# Altium project JacdacTempRhEc30 116.PrjPCB
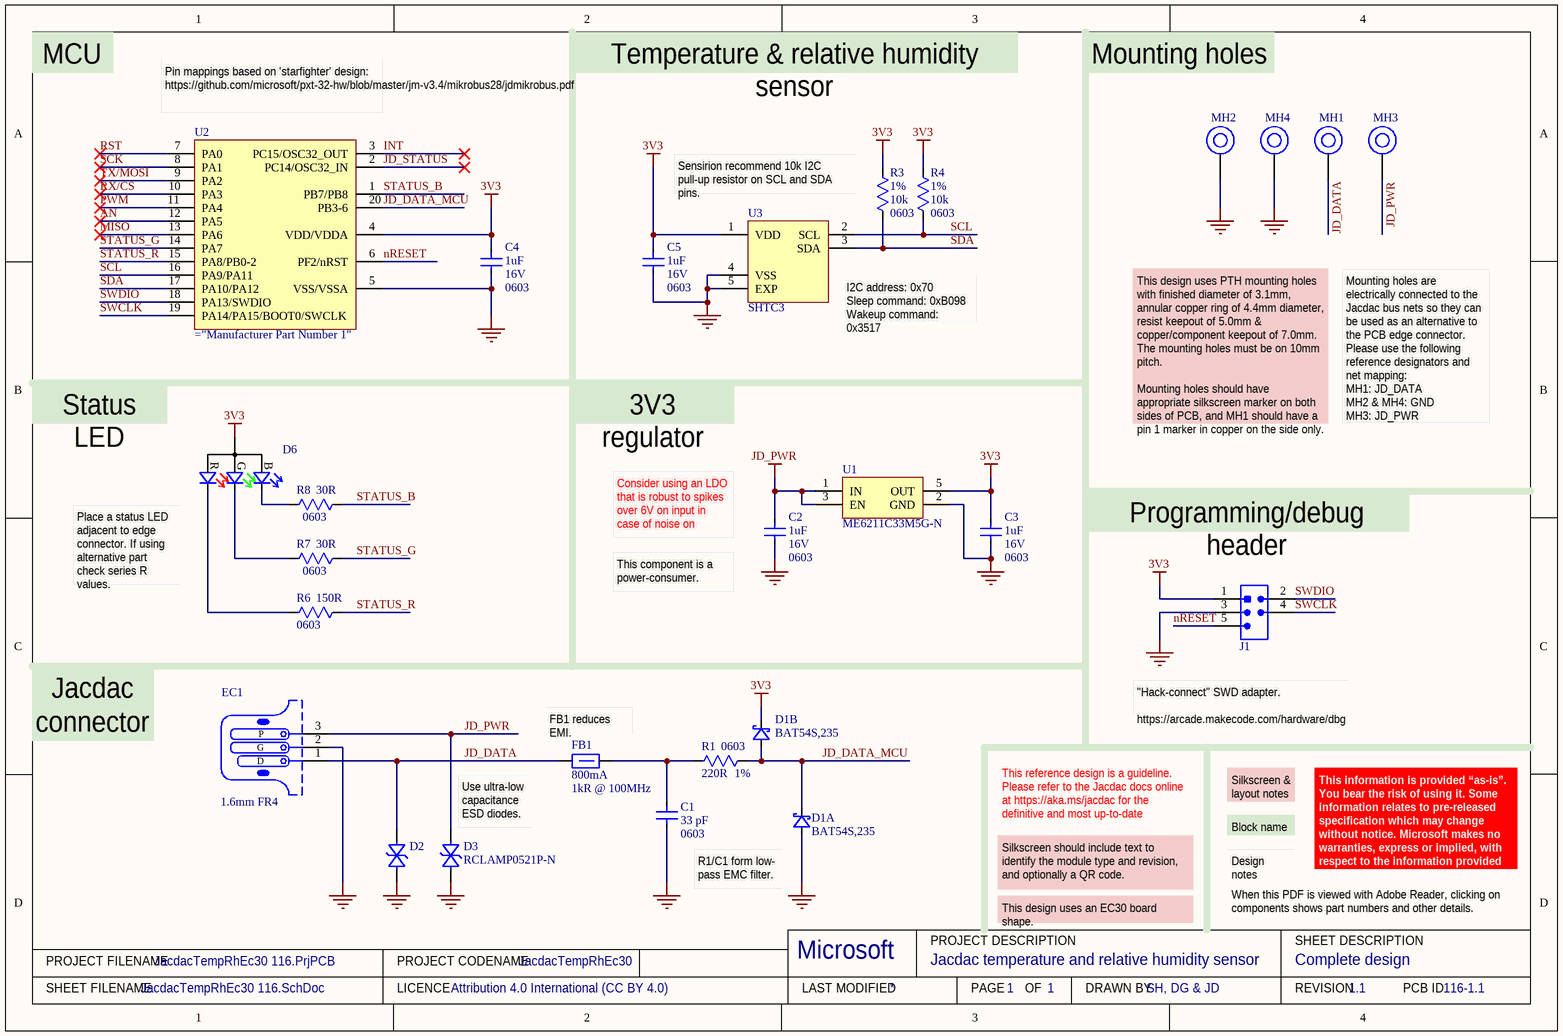
[diagram p0: JacdacTempRhEc30 116.SchDoc]
ProjectCodeName: JacdacTempRhEc30; ProjectCodenameDescription: Jacdac temperature and relative humidity sensor; ProjectCodenameID: 116; ProjectDrawnBy: SH, DG & JD; ProjectLicenceTerms: Attribution 4.0 International (CC BY 4.0); ProjectRevision: 1.1
1 sheet, 25 parts. Net scope: global (net labels, ports and power ports of the same name join across sheets).
Board file: JacdacTempRhEc30 116.PcbDoc

## Sheet JacdacTempRhEc30 116.SchDoc: Complete design
size A4; DrawnBy: SH, DG & JD; DocumentNumber: 1; Revision: 1.1; SheetNumber: 1; SheetTotal: 1; VersionControl_RevNumber: 1

### Parts
C1  33 pF  Case/Package: 0603  [CC0603]
C2  Voltage: 16V  Case/Package: 0603  Capacitance: 1uF  [C0603 - without outline]  (hidden comment: 1uF 16V)
C3  Voltage: 16V  Case/Package: 0603  Capacitance: 1uF  [C0603 - without outline]  (hidden comment: 1uF 16V)
C4  Voltage: 16V  Case/Package: 0603  Capacitance: 1uF  [C0603 - without outline]  (hidden comment: 1uF 16V)
C5  Voltage: 16V  Case/Package: 0603  Capacitance: 1uF  [C0603 - without outline]  (hidden comment: 1uF 16V)
D1  Manufacturer Part Number: BAT54S,235  [NXP-BAT54S-TO-236AB - without outline]  (hidden comment: BAT54S)  (parts A,B of 2)
D2  RCLAMP0521P-N  [TVS 0402 - XL]  (value not drawn)
D3  RCLAMP0521P-N  [TVS 0402 - XL]
D6  TZ-P4-1615RGBTCA1-0.55T  [TZ-P4-1615RGBTCA1-0.55T]  (value not drawn)
EC1  PCB Type: 1.6mm FR4  [JACDAC_EDGE_CONNECTOR_NO_TRACES]  (hidden comment: 3 pin JACDAC edge connector)  (no BOM)
FB1  Current Rating: 800mA  Impedance: 1kR @ 100MHz  [TDK MPZ1608 0.8mm - without outline]  (hidden comment: TDK MPZ1608S102ATA00)
J1  Hack Connect Mini 1.27 mm pitch 2-row  [HACK_CONNECT_MINI_5_X_1_27]  (value not drawn)  (no BOM)
MH1  MH_7.0MMK_4.4MMC_3.1MMD_PTH  [MH_7.0MMK_4.4MMC_3.1MMD_PTH]  (value not drawn)  (no BOM)
MH2  MH_7.0MMK_4.4MMC_3.1MMD_PTH  [MH_7.0MMK_4.4MMC_3.1MMD_PTH]  (value not drawn)  (no BOM)
MH3  MH_7.0MMK_4.4MMC_3.1MMD_PTH  [MH_7.0MMK_4.4MMC_3.1MMD_PTH]  (value not drawn)  (no BOM)
MH4  MH_7.0MMK_4.4MMC_3.1MMD_PTH  [MH_7.0MMK_4.4MMC_3.1MMD_PTH]  (value not drawn)  (no BOM)
R1  Tolerance: 1%  Case/Package: 0603  [RC0603]  (hidden comment: 220R)
R3  Tolerance: 1%  Case/Package: 0603  [RC0603]  (hidden comment: 10k)
R4  Tolerance: 1%  Case/Package: 0603  [RC0603]  (hidden comment: 10k)
R6  Case/Package: 0603  [RC0603]  (hidden comment: 150R)
R7  Case/Package: 0603  [RC0603]  (hidden comment: 30R)
R8  Case/Package: 0603  [RC0603]  (hidden comment: 30R)
U1  ME6211C33M5G-N  [MICRONE-SOT23-5]
U2  (no value)  [20-TSSOP]
U3  SHTC3  [SHTC3_4_WDFN]

### Nets
3V3: C3.2 C4.2 C5.2 D1.2(K) D6.1(A) J1.1(VCC) R3.1 R4.1 U1.5(OUT) U2.4(VDD/VDDA) U3.1(VDD)
GND: C1.1 C2.1 C3.1 C4.1 C5.1 D1.1(A) D2.2(A) D3.2(A) EC1.2(G) J1.3(GND) MH2.1 MH4.1 U1.2(GND) U2.5(VSS/VSSA) U3.4(VSS) U3.5(EXP)
JD_PWR: C2.2 D3.1(K) EC1.3(P) MH3.1 U1.1(IN) U1.3(EN)
AN: U2.12(PA5)
INT: U2.3(PC15/OSC32_OUT)
JD_DATA: D2.1(K) EC1.1(D) FB1.1 MH1.1
JD_DATA_MCU: D1.3(K) R1.2 U2.20(PB3-6)
JD_STATUS: U2.2(PC14/OSC32_IN)
MISO: U2.13(PA6)
nRESET: J1.5(RESET) U2.6(PF2/nRST)
PWM: U2.11(PA4)
RST: U2.7(PA0)
RX/CS: U2.10(PA3)
SCK: U2.8(PA1)
SCL: R4.2 U2.16(PA9/PA11) U3.2(SCL)
SDA: R3.2 U2.17(PA10/PA12) U3.3(SDA)
STATUS_B: R8.2 U2.1(PB7/PB8)
STATUS_G: R7.2 U2.14(PA7)
STATUS_R: R6.2 U2.15(PA8/PB0-2)
SWCLK: J1.4(SWCLK) U2.19(PA14/PA15/BOOT0/SWCLK)
SWDIO: J1.2(SWDIO) U2.18(PA13/SWDIO)
TX/MOSI: U2.9(PA2)
NetC1_2: C1.2 FB1.2 R1.1
NetD6_2: D6.2(R) R6.1
NetD6_3: D6.3(G) R7.1
NetD6_4: D6.4(B) R8.1

### Notes on the sheet
- MCU
- (near U2) Pin mappings based on 'starfighter' design: https://github.com/microsoft/pxt-32-hw/blob/master/jm-v3.4/mikrobus28/jdmikrobus.pdf
- Temperature & relative humidity sensor
- Mounting holes
- Sensirion recommend 10k I2C pull-up resistor on SCL and SDA pins.
- (near U3) I2C address: 0x70
  Sleep command: 0xB098
  Wakeup command: 0x3517
- Mounting holes are electrically connected to the Jacdac bus nets so they can be used as an alternative to the PCB edge connector. Please use the following reference designators and net mapping:
- Status LED
- 3V3 regulator
- This design uses PTH mounting holes with finished diameter of 3.1mm, annular copper ring of 4.4mm diameter, resist keepout of 5.0mm & copper/component keepout of 7.0mm. The mounting holes must be on 10mm pitch.
  Mounting holes should have appropriate silkscreen marker on both sides of PCB, and MH1 should have a pin 1 marker in copper on the side only.
- MH1: JD_DATA
  MH2 & MH4: GND
  MH3: JD_PWR
- (near D6) Place a status LED adjacent to edge connector. If using alternative part check series R values.
- (near C2) Consider using an LDO that is robust to spikes over 6V on input in case of noise on JD_PWR.
- Programming/debug header
- (near C2) This component is a power-consumer.
- Jacdac
- "Hack-connect" SWD adapter.
  https://arcade.makecode.com/hardware/dbg
- connector
- (near FB1) FB1 reduces EMI.
- (near D3) Use ultra-low capacitance ESD diodes.
- This reference design is a guideline. Please refer to the Jacdac docs online at https://aka.ms/jacdac for the definitive and most up-to-date information.
- Block name
- Silkscreen & layout notes
- R1/C1 form low-
  pass EMC filter.
- This design uses an EC30 board shape.
- Silkscreen should include text to identify the module type and revision, and optionally a QR code.
- D1 clamps JD_DATA to protect MCU.
- Design notes
- When this PDF is viewed with Adobe Reader, clicking on components shows part numbers and other details.
- This information is provided “as-is”. You bear the risk of using it. Some information relates to pre-released specification which may change without notice. Microsoft makes no warranties, express or implied, with respect to the information provided here.
- PROJECT FILENAME
- PROJECT CODENAME
- Microsoft
- PROJECT DESCRIPTION
- SHEET DESCRIPTION
- SHEET FILENAME
- LICENCE
- LAST MODIFIED
- PAGE
- OF
- DRAWN BY
- REVISION
- PCB ID

### Library data of the parts
C1 = CC0603JRNPO9BN330: 33pF 0603 100V C0G/NPO; Manufacturer: Yageo; Dielectric: C0G; Tolerance: 5%; Supplier 1: Digi-Key; Manufacturer Part Number: CC0603JRNPO9BN330; RoHS: Yes; Category: Ceramic Capacitors; Mount: Surface Mount; Weight: 7.1E-05oz; Case Code (Imperial): 0603; Case Code (Metric): 1608; Min Operating Temperature: -55°C; Max Operating Temperature: 125°C; Capacitance: 33pF; Termination: SMD/SMT; Composition: Ceramic; Packaging: Tape and Reel; Voltage Rating: 100V; Voltage Rating (DC): 100V; Length: 1.6mm; Height: 0.8mm; Thickness: 0.035inch; Depth: 0.8mm; Width: 0.8mm; Lead Free: Lead Free; ComponentLink1URL: https://datasheet.ciiva.com/13207/upy-gp-np0-16v-to-50v-8-13207786.pdf; ComponentLink1Description: Online datasheet; Manufacturer 1: Yageo; Manufacturer Part Number 1: CC0603JRNPO9BN330
C2-C5 = CL10A105KO8NNNC: SMD Multilayer Ceramic Capacitor, 1 µF, 16 V, 0603 [1608 Metric], ± 10%, X5R, CL Series; Manufacturer: Samsung; ComponentLink1URL: https://datasheet.lcsc.com/lcsc/1811021622_Samsung-Electro-Mechanics-CL10A105KO8NNNC_C1592.pdfq; ComponentLink1Description: Online datasheet; Supplier 1: Digi-Key; Manufacturer Part Number: CL10A105KO8NNNC; RoHS: Yes; Category: Ceramic Capacitors; Stock 1: 3575337; Pricing 1: 1=0.10000, 10=0.03600, 50=0.01960, 100=0.01600, 500=0.01144, 1000=0.00898 (USD); Mount: Surface Mount; Case Code (Metric): 1608; Case Code (Imperial): 0603; Material: Ceramic; Contact Plating: Tin; Min Operating Temperature: -55°C; Max Operating Temperature: 85°C; Tolerance: 10%; Package Quantity: 1; Packaging: Tape and Reel; Voltage Rating: 16V; Dielectric: X5R; Voltage Rating (DC): 16V; Series: CL; Construction: Flat; Length: 1.6mm; Width: 0.031inch; Height: 0.8mm; Thickness: 0.035inch; Depth: 0.8mm; Radiation Hardening: No; Lead Free: Lead Free; RoHS Compliant: Yes; Supplier 2: Farnell; Supplier 3: RSComponents; Supplier 4: Mouser; Supplier Part Number 1: 1276-1034-1-ND; Supplier Part Number 2: 3013384; Supplier Part Number 3: 7664780; Supplier Part Number 4: 187-CL10A105KO8NNNC; Supplier 5: LCSC; Supplier Part Number 5: C1592; Manufacturer 1: Samsung; Manufacturer Part Number 1: CL10A105KO8NNNC
D1 = BAT54S: DIODE ARRAY SCHOTTKY 30V SOT23; Manufacturer: Nexperia; Supplier 1: Digi-Key; RoHS: No; Category: Rectifier Diodes; Stock 1: 14011; Pricing 1: 1=0.13000, 10=0.11900, 100=0.05610, 500=0.03326, 1000=0.02185, 5000=0.02138 (USD); ComponentLink1URL: https://assets.nexperia.com/documents/data-sheet/BAT54_SER.pdf; ComponentLink1Description: NXP datasheet online; Supplier 2: Mouser; Supplier 3: RSComponents; Supplier Part Number 2: 771-BAT54S235; Supplier Part Number 3: 1707990; Supplier Part Number 1: 1727-1868-1-ND; Manufacturer 1: Nexperia; Manufacturer Part Number 1: BAT54S,235
D2 D3 = RCLAMP0521P-N: Bidirectional 5V (Max) 6V 16V 3.5A (8/20us) 0402 TVS RoHS; Manufacturer: Born Semiconductor; Package: 0402; Created By: D Gakure; Checked By: ?; Supplier1: LCSC; Supplier1 Part Number: C316043; ComponentLink1Description: Online datasheet; ComponentLink1URL: https://datasheet.lcsc.com/szlcsc/Bourne-Semicon-Shenzhen-RCLAMP0521P-N_C316043.pdf; Manufacturer Part Number: RCLAMP0521P-N; Manufacturer 1: Born Semiconductor; Manufacturer Part Number 1: RCLAMP0521P-N
D6 = TZ-P4-1615RGBTCA1-0.55T: 1615 Light Emitting Diodes (LED) RoHS; Manufacturer: TUOZHAN; Manufacturer Part Number: TZ-P4-1615RGBTCA1-0.55T; Category: Optoelectronics; Package: 1615; ComponentLink1Description: Online datasheet; ComponentLink1URL: https://datasheet.lcsc.com/szlcsc/2009041238_TUOZHAN-TZ-P4-1615RGBTCA1-0-55T_C779813.pdf; RoHS: RoHS Compliant; Supplier 1: LCSC; Size / Dimension: 1.6x1.5mm; Supplier Part Number 1: C779813; Packaging: Tape & Reel (TR); Created By: D. Gakure; Checked By: ?; Manufacturer 1: TUOZHAN; Manufacturer Part Number 1: TZ-P4-1615RGBTCA1-0.55T
EC1 = Jacdac edge connector: 3 pin Jacdac edge connector 1.27mm pitch; Manufacturer Part Number: JACDAC_EDGE_CONNECTOR; Checked By: ?; Created By: D. Gakure; ComponentLink1Description: Yuliang JACDAC cable connector drawing online; ComponentLink1URL: https://github.com/microsoft/jacdac-mdk/blob/main/connector/JACDAC-Connector-by-Yuliang-2020-11-28.pdf; ComponentLink2Description: JACDAC PCB edge connector spec onlin; ComponentLink2URL: https://github.com/microsoft/jacdac-mdk/blob/main/connector/JACDAC_PCB_Edge_Connector_Drawing_JD-PEC-01_rev_01.pdf
FB1 = TDK MPZ1608S102ATA00: 0603 1k@100MHz 0.8A chip; Core Material: Ferrite; Tolerance: 25%; DC Resistance (DCR): 300mR; Supplier 1: Digi-Key; Stock 1: 113542; Pricing 1: 1=0.1, 10=0.079, 25=0.0716, 50=0.0644, 100=0.0472, 250=0.03432, 500=0.03146, 1000=0.02717 (USD); Mount: Surface Mount; Case/Package: 0603; Case Code (Metric): 1608; Case Code (Imperial): 0603; Package Quantity: 4000; Packaging: Tape and Reel; Max DC Current: 800mA; Length: 0.063inch; Height: 0.037inch; Width: 0.031inch; ComponentLink2URL: https://www.mouser.co.uk/datasheet/2/400/eads_commercial_power_mpz1608_en-923650.pdf; ComponentLink2Description: datasheet online; Supplier 2: Mouser; ComponentLink3Description: datasheet; ComponentLink3URL: Y:\System\Altium\Libraries 2014\TDK\Datasheets\eads_commercial_power_mpz1608_en-923650.pdf; Supplier Part Number 1: 445-8694-1-ND; Supplier Part Number 2: 810-MPZ1608S102ATA00; Manufacturer: TDK; Manufacturer Part Number: MPZ1608S102ATA00; Manufacturer 1: TDK; Manufacturer Part Number 1: MPZ1608S102ATA00
J1 = HACK_CONNECT_MINI
MH1-MH4 = MH_7.0MMK_4.4MMC_3.1MMD_PTH: Mounting Hole 7.0mm keepout, 4.4mm annualar ring and 3.1mm Drill PTH; Hole Size: M3; Hole Diameter: 3.1mm; Hole Type: PTH; Annular Ring: 4.4mm; Hole Clearance: 7.0mm
R1 = RC0603FR-07220RL: Res Thick Film 0603 220 Ohm 1% 0.1W(1/10W) ±100ppm/°C Pad SMD T/R; Manufacturer: Yageo; Max Power Dissipation: 100mW; Voltage Rating: 50V; ComponentLink1URL: https://datasheet.ciiva.com/11819/0900766b80f96399-11819290.pdf; ComponentLink1Description: Online datasheet; Supplier 1: Digi-Key; Manufacturer Part Number: RC0603FR-07220RL; RoHS: Yes; Category: Chip SMD Resistors; Stock 1: 242327; Pricing 1: 1=0.10000, 10=0.02400, 100=0.00970, 1000=0.00436, 2500=0.00378 (USD); Number of Pins: 2; Case Code (Imperial): 0603; Case Code (Metric): 1608; Size Code: 0603; Min Operating Temperature: -55°C; Max Operating Temperature: 155°C; Packaging: Tape and Reel; Resistor Type: Thick Film; Number of Terminations: 2; Temperature Coefficient: 100ppm/°C; Series: RC; Power Rating: 100mW; Package Quantity: 1; Features: Moisture Resistant; Voltage Rating (DC): 50V; Termination: SMD/SMT; Construction: Rectangular; Length: 1.6mm; Width: 0.031inch; Height: 0.022inch; Depth: 0.8mm; RoHS Compliant: Yes; REACH SVHC: No SVHC; Military Standard: Not; Lead Free: Lead Free; Supplier 2: Farnell; Supplier 3: RSComponents; Supplier 4: Mouser; Supplier Part Number 1: 311-220HRCT-ND; Supplier Part Number 3: 1995497; Supplier Part Number 2: 9238409; Supplier Part Number 4: 603-RC0603FR-07220RL; Supplier 5: LCSC; Supplier Part Number 5: C107696; Resistance Tolerance: 1%; Resistance: 220R; Manufacturer 1: Yageo; Manufacturer Part Number 1: RC0603FR-07220RL
R3 R4 = RC0603FR-07220RL: Res Thick Film 0603 10k ohm 1% 0.1W(1/10W) ±100ppm/°C Pad SMD T/R; Manufacturer: Yageo; Manufacturer Part Number: RC0603FR-0710KL; Max Power Dissipation: 100mW; Voltage Rating: 50V; ComponentLink1URL: https://datasheet.ciiva.com/11819/0900766b80f96399-11819290.pdf; ComponentLink1Description: Online datasheet; RoHS: Yes; Category: Chip SMD Resistors; Number of Pins: 2; Case Code (Imperial): 0603; Case Code (Metric): 1608; Size Code: 0603; Min Operating Temperature: -55°C; Max Operating Temperature: 155°C; Packaging: Tape and Reel; Resistor Type: Thick Film; Number of Terminations: 2; Temperature Coefficient: 100ppm/°C; Series: RC; Power Rating: 100mW; Package Quantity: 1; Features: Moisture Resistant; Voltage Rating (DC): 50V; Termination: SMD/SMT; Construction: Rectangular; Length: 1.6mm; Width: 0.031inch; Height: 0.022inch; Depth: 0.8mm; RoHS Compliant: Yes; REACH SVHC: No SVHC; Military Standard: Not; Lead Free: Lead Free; Resistance Tolerance: 1%; Resistance: 10k; Manufacturer 1: Yageo; Manufacturer Part Number 1: RC0603FR-0710KL
R6 = RC0603FR-07150RL: Res General Purpose Thick Film 0603 150 Ohm 1% 1/10W ±100ppm/°C Molded SMD Paper T/R; Manufacturer: Yageo; Power Rating: 100mW; Voltage Rating (DC): 50V; ComponentLink1URL: https://datasheet.ciiva.com/11819/0900766b80f96399-11819290.pdf; ComponentLink1Description: Online datasheet; Supplier 1: Digi-Key; Manufacturer Part Number: RC0603FR-07150RL; RoHS: Yes; Category: Chip SMD Resistors; Stock 1: 2262542; Pricing 1: 1=0.10000, 10=0.02400, 100=0.00970, 1000=0.00436, 2500=0.00378 (USD); Number of Pins: 2; Case Code (Imperial): 0603; Case Code (Metric): 1608; Size Code: 0603; Min Operating Temperature: -55°C; Max Operating Temperature: 155°C; Tolerance: 1%; Packaging: Tape and Reel; Temperature Coefficient: 100ppm/°C; Voltage Rating: 50V; Package Quantity: 5000; Termination: SMD/SMT; Resistor Type: Thick Film; Features: Moisture Resistant; Series: RC; Max Power Dissipation: 100mW; Number of Terminations: 2; Construction: Rectangular; Length: 1.6mm; Width: 0.8mm; Height: 0.45mm; Depth: 0.8mm; REACH SVHC: No SVHC; Lead Free: Lead Free; Military Standard: Not; RoHS Compliant: Yes; Supplier 2: Farnell; Supplier 3: RSComponents; Supplier 4: Mouser; Supplier Part Number 1: 311-150HRCT-ND; Supplier Part Number 2: 9238387; Supplier Part Number 3: 1995464; Supplier Part Number 4: 603-RC0603FR-07150RL; Supplier 5: LCSC; Supplier Part Number 5: C114608; Resistance Tolerance: 1%; Resistance: 150R; Manufacturer 1: Yageo; Manufacturer Part Number 1: RC0603FR-07150RL
R7 R8 = RC0603FR-0730RL: Res Thick Film 0603 30 Ohm 1% 0.1W(1/10W) ±100ppm/C Pad SMD T/R; Manufacturer: Yageo; Temperature Coefficient: 100ppm/°C; Voltage Rating (DC): 50V; Power Rating: 100mW; ComponentLink1URL: https://datasheet.ciiva.com/11819/0900766b80f96399-11819290.pdf; ComponentLink1Description: Online datasheet; Supplier 1: Digi-Key; Manufacturer Part Number: RC0603FR-0730RL; RoHS: Yes; Category: Chip SMD Resistors; Stock 1: 181493; Pricing 1: 1=0.10000, 10=0.02400, 100=0.00970, 1000=0.00436, 2500=0.00378 (USD); Mount: Surface Mount; Case Code (Imperial): 0603; Size Code: 0603; Min Operating Temperature: -55°C; Max Operating Temperature: 155°C; Resistor Type: Thick Film; Packaging: Tape and Reel; Package Quantity: 1; Voltage Rating: 50V; Number of Terminations: 2; Termination: SMD/SMT; Max Power Dissipation: 100mW; Features: Moisture Resistant; Series: RC; Construction: Rectangular; Technology: THICK FILM; Length: 0.063inch; Width: 0.031inch; Height: 0.022inch; Depth: 0.8mm; Lead Free: Lead Free; Military Standard: Not; RoHS Compliant: Yes; ComponentLink5URL: https://datasheet.ciiva.com/2455/pyu-r-int-thick-7-2455121.pdf?src-supplier=Digi-Key; ComponentLink5Description: https://datasheet.ciiva.com/2455/pyu-r-int-thick-7-2455121.pdf?src-supplier=Digi-Key; Supplier 2: Farnell; Supplier 3: Mouser; Case Code (Metric): 1608; Supplier Part Number 1: 311-30.0HRCT-ND; Supplier Part Number 2: 3495813; Supplier Part Number 3: 603-RC0603FR-0730RL; Supplier 5: LCSC; Supplier Part Number 5: C128060; Tolerance: 1%; Resistance: 30R; Manufacturer 1: Yageo; Manufacturer Part Number 1: RC0603FR-0730RL
U1 = ME6211C33M5G-N: 6V 260mV @ 200mA(typ) - - Fixed 3.3V SOT-23-5 Linear Voltage Regulators (LDO) ROHS; manufacturer: MICRONE(Nanjing Micro One Elec); Output Current: 500mA; Output Configuration: Positive; Number of Regulators: 1; Max Input Voltage: 6; Dropout Voltage: 200mV; Supplier Part Number: C82942; Category: Voltage Regulators - Linear; Stock 1: 32529; Pricing 1: 1=0.33000, 10=0.24900, 25=0.21760, 100=0.12440, 250=0.11664, 500=0.09330, 1000=0.07153 (USD); Mount: Surface Mount; Case/Package: SOT-23-5; Supplier 1: LCSC; Output Type: Fixed; Min Output Voltage: 3.3V; ComponentLink3URL: https://datasheet.lcsc.com/lcsc/1811131510_MICRONE-Nanjing-Micro-One-Elec-ME6211C33M5G-N_C82942.pdf; ComponentLink3Description: On Semi datasheet online; Created: DG; Manufacturer Part Number: ME6211C33M5G-N; Manufacturer 1: MICRONE(Nanjing Micro One Elec); Manufacturer Part Number 1: ME6211C33M5G-N
U2 = STM32G030F6P6: ARM® Cortex®-M0+ series IC 64MHz 32KB 20-TSSOP; Manufacturer: STMicroelectronics; ComponentLink1Description: Online datasheet; ComponentLink1URL: https://www.st.com/resource/en/datasheet/stm32g030f6.pdf; ComponentLink2Description: Online reference manual; ComponentLink2URL: https://www.st.com/resource/en/reference_manual/rm0454-stm32g0x0-advanced-armbased-32bit-mcus-stmicroelectronics.pdf; Supplier 1: Digi-Key; Manufacturer Part Number: STM32G030F6P6; RoHS: Yes; Category: Microcontrollers; Pricing 1: 1=1.85000, 10=1.65300, 74=1.56905, 148=1.28892, 296=1.20486, 444=1.06475, 962=0.93400 (USD); RoHS Compliant: Yes; Supplier 2: Farnell; Supplier 3: Mouser; Supplier 10: LCSC; Supplier Part Number 1: 497-STM32G030F6P6-ND; Supplier Part Number 2: 3294301; Supplier Part Number 3: 511-STM32G030F6P6; Supplier Part Number 10: C724040; Manufacturer 1: STMicroelectronics; Manufacturer Part Number 1: STM32G030F6P6
U3 = SHTC3: Humidity Temperature Sensor 0 ~ 100% RH I²C ±2% RH 8s Surface Mount; Manufacturer: Sensirion; Output Type: I2C; Supplier 1: Digi-Key; RoHS: No; Stock 1: 10507; Pricing 1: 1=2.98000, 5=2.76200, 10=2.29500, 25=1.91240, 50=1.70000, 100=1.61500, 500=1.36000, 1000=1.27500 (USD); Mount: Surface Mount; Case/Package: DFN; Min Operating Temperature: -40°C; Max Operating Temperature: 125°C; Packaging: Tape and Reel; Sensor Type: Temperature; Accuracy: 2%; Response Time: 8s; ComponentLink1URL: https://media.digikey.com/pdf/Data%20Sheets/Sensirion%20PDFs/HT_DS_SHTC3_D1.pdf; ComponentLink1Description: Online datasheet; Supplier 2: Mouser; Stock 2: 13209; Pricing 2: 1=2.44000, 10=2.03000, 50=1.50000, 100=1.43000, 1000=1.13000, 10000=0.93700 (USD); Supplier 3: Farnell; Stock 3: 3479; Pricing 3: 1=2.94000, 25=1.98000, 50=1.84000, 250=1.59000, 500=1.56000 (GBP); Supplier 4: RSComponents; Stock 4: 1085; Pricing 4: 2500=1.13700 (USD); Category: Sensors Transducers; Created By: D. Gakure; Checked By: ?; Supplier Part Number 4: 1950668; Supplier Part Number 3: 3106918; Supplier Part Number 2: 403-SHTC3; Supplier Part Number 1: 1649-1100-1-ND; Manufacturer Part Number: SHTC3; Manufacturer 1: Sensirion; Manufacturer Part Number 1: SHTC3